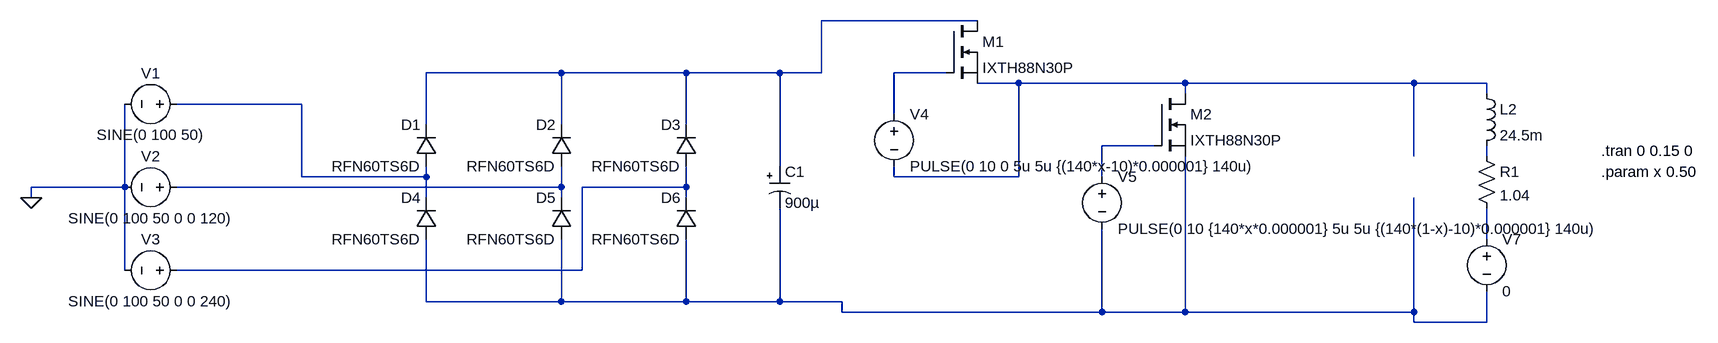
[diagram p0: schematic spicemodel.asc]
spicemodel.asc, the LTspice schematic file:
Version 4
SHEET 1 3436 680
WIRE 1664 32 1424 32
WIRE 1024 112 816 112
WIRE 1216 112 1024 112
WIRE 1360 112 1216 112
WIRE 1424 112 1424 32
WIRE 1424 112 1360 112
WIRE 1616 112 1536 112
WIRE 1728 128 1664 128
WIRE 1984 128 1728 128
WIRE 2336 128 1984 128
WIRE 2448 128 2336 128
WIRE 1984 144 1984 128
WIRE 2448 144 2448 128
WIRE 624 160 432 160
WIRE 1536 176 1536 112
WIRE 816 192 816 112
WIRE 1024 192 1024 112
WIRE 1216 192 1216 112
WIRE 1936 224 1856 224
WIRE 2336 240 2336 128
WIRE 2448 240 2448 224
WIRE 1360 256 1360 112
WIRE 624 272 624 160
WIRE 816 272 816 256
WIRE 816 272 624 272
WIRE 1536 272 1536 256
WIRE 1728 272 1728 128
WIRE 1728 272 1536 272
WIRE 1856 272 1856 224
WIRE 352 288 352 160
WIRE 352 288 208 288
WIRE 1024 288 1024 256
WIRE 1024 288 432 288
WIRE 1216 288 1216 256
WIRE 1216 288 1056 288
WIRE 208 304 208 288
WIRE 816 304 816 272
WIRE 1024 304 1024 288
WIRE 1216 304 1216 288
WIRE 2448 368 2448 320
WIRE 352 416 352 288
WIRE 1056 416 1056 288
WIRE 1056 416 432 416
WIRE 816 464 816 368
WIRE 1024 464 1024 368
WIRE 1024 464 816 464
WIRE 1216 464 1216 368
WIRE 1216 464 1024 464
WIRE 1360 464 1360 320
WIRE 1360 464 1216 464
WIRE 1456 464 1360 464
WIRE 1456 480 1456 464
WIRE 1856 480 1856 352
WIRE 1856 480 1456 480
WIRE 1984 480 1984 240
WIRE 1984 480 1856 480
WIRE 2336 480 2336 304
WIRE 2336 480 1984 480
WIRE 2336 496 2336 480
WIRE 2448 496 2448 448
WIRE 2448 496 2336 496
FLAG 208 304 0
SYMBOL voltage 448 160 R90
WINDOW 0 -32 56 VBottom 2
WINDOW 3 32 56 VTop 2
WINDOW 123 0 0 Left 0
WINDOW 39 0 0 Left 0
SYMATTR InstName V1
SYMATTR Value SINE(0 100 50)
SYMBOL voltage 448 288 R90
WINDOW 0 -32 56 VBottom 2
WINDOW 3 32 56 VTop 2
WINDOW 123 0 0 Left 0
WINDOW 39 0 0 Left 0
SYMATTR InstName V2
SYMATTR Value SINE(0 100 50 0 0 120)
SYMBOL voltage 448 416 R90
WINDOW 0 -32 56 VBottom 2
WINDOW 3 32 56 VTop 2
WINDOW 123 0 0 Left 0
WINDOW 39 0 0 Left 0
SYMATTR InstName V3
SYMATTR Value SINE(0 100 50 0 0 240)
SYMBOL diode 832 256 R180
WINDOW 0 24 64 Left 2
WINDOW 3 24 0 Left 2
SYMATTR InstName D1
SYMATTR Value RFN60TS6D
SYMBOL diode 1040 256 R180
WINDOW 0 24 64 Left 2
WINDOW 3 24 0 Left 2
SYMATTR InstName D2
SYMATTR Value RFN60TS6D
SYMBOL diode 1232 256 R180
WINDOW 0 24 64 Left 2
WINDOW 3 24 0 Left 2
SYMATTR InstName D3
SYMATTR Value RFN60TS6D
SYMBOL diode 832 368 R180
WINDOW 0 24 64 Left 2
WINDOW 3 24 0 Left 2
SYMATTR InstName D4
SYMATTR Value RFN60TS6D
SYMBOL diode 1040 368 R180
WINDOW 0 24 64 Left 2
WINDOW 3 24 0 Left 2
SYMATTR InstName D5
SYMATTR Value RFN60TS6D
SYMBOL diode 1232 368 R180
WINDOW 0 24 64 Left 2
WINDOW 3 24 0 Left 2
SYMATTR InstName D6
SYMATTR Value RFN60TS6D
SYMBOL polcap 1344 256 R0
WINDOW 3 24 56 Left 2
SYMATTR Value 900µ
SYMATTR InstName C1
SYMATTR Description Capacitor
SYMATTR Type cap
SYMATTR SpiceLine V=200 Irms=2.08 Rser=0.1485 Lser=16.6573n
SYMBOL nmos 1616 32 R0
SYMATTR InstName M1
SYMATTR Value IXTH88N30P
SYMBOL nmos 1936 144 R0
SYMATTR InstName M2
SYMATTR Value IXTH88N30P
SYMBOL voltage 1536 160 R0
WINDOW 123 0 0 Left 0
WINDOW 39 0 0 Left 0
SYMATTR InstName V4
SYMATTR Value PULSE(0 10 0 5u 5u {(140*x-10)*0.000001} 140u)
SYMBOL voltage 1856 256 R0
WINDOW 123 0 0 Left 0
WINDOW 39 0 0 Left 0
SYMATTR InstName V5
SYMATTR Value PULSE(0 10 {140*x*0.000001} 5u 5u {(140*(1-x)-10)*0.000001} 140u)
SYMBOL res 2432 224 R0
SYMATTR InstName R1
SYMATTR Value 1.04
SYMBOL ind 2432 128 R0
SYMATTR InstName L2
SYMATTR Value 24.5m
SYMBOL voltage 2448 352 R0
WINDOW 123 0 0 Left 0
WINDOW 39 0 0 Left 0
SYMATTR InstName V7
SYMATTR Value 0
TEXT 2624 232 Left 2 !.tran 0 0.15 0
TEXT 2624 264 Left 2 !.param x 0.50

The netlist it stands for:
* spicemodel.asc
V1 N004 0 SINE(0 100 50)
V2 N007 0 SINE(0 100 50 0 0 120)
V3 N008 0 SINE(0 100 50 0 0 240)
D1 N004 N001 RFN60TS6D
D2 N007 N001 RFN60TS6D
D3 N008 N001 RFN60TS6D
D4 N010 N004 RFN60TS6D
D5 N010 N007 RFN60TS6D
D6 N010 N008 RFN60TS6D
C1 N001 N010 900µ V=200 Irms=2.08 Rser=0.1485 Lser=16.6573n
M1 N001 N002 N003 N003 IXTH88N30P
M2 N003 N005 N010 N010 IXTH88N30P
V4 N002 N003 PULSE(0 10 0 5u 5u {(140*x-10)*0.000001} 140u)
V5 N005 N010 PULSE(0 10 {140*x*0.000001} 5u 5u {(140*(1-x)-10)*0.000001} 140u)
R1 N006 N009 1.04
L2 N003 N006 24.5m
V7 N009 N010 0
.model D D
.lib standard.dio
.model NMOS NMOS
.model PMOS PMOS
.lib standard.mos
.tran 0 0.15 0
.param x 0.50
.backanno
.end